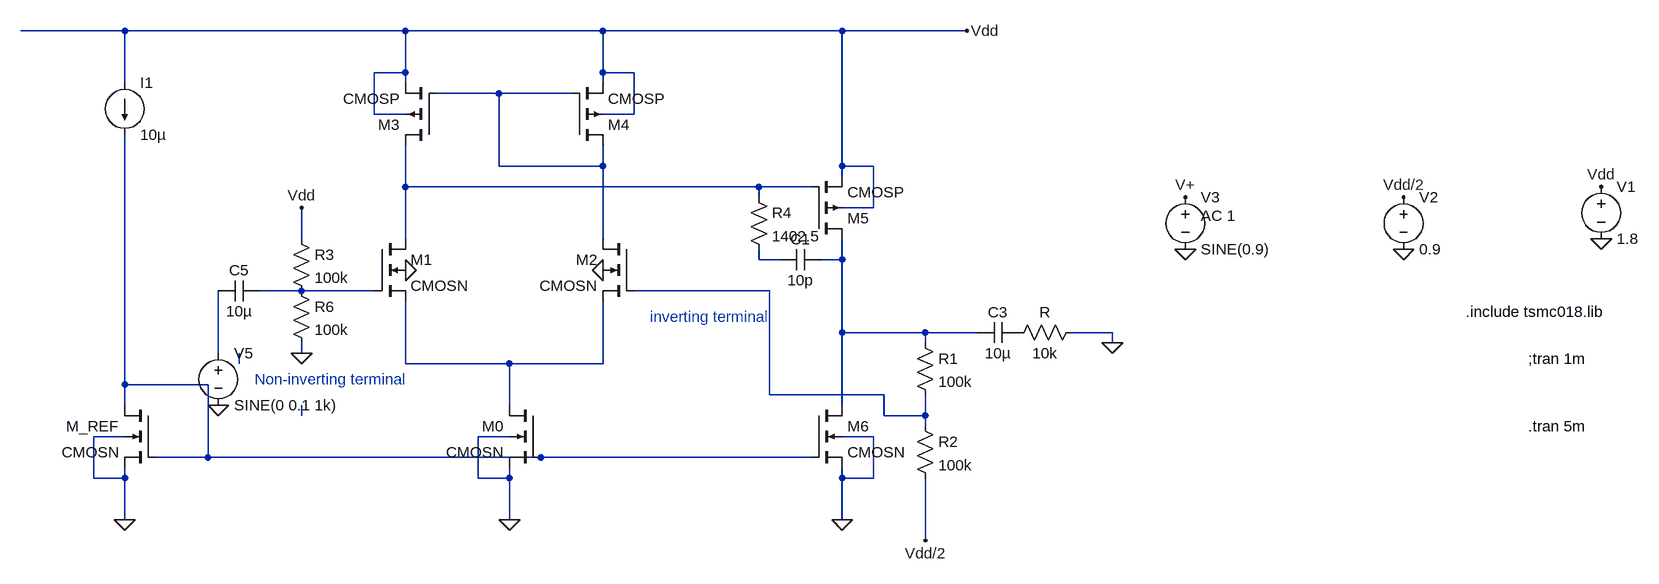
[diagram p0: schematic Closed loop 2 stage OTA.asc]
Closed loop 2 stage OTA.asc, the LTspice schematic file:
Version 4
SHEET 1 1344 1092
WIRE -992 -288 -1152 -288
WIRE -560 -288 -992 -288
WIRE -256 -288 -560 -288
WIRE 112 -288 -256 -288
WIRE 304 -288 112 -288
WIRE -560 -224 -560 -288
WIRE -560 -224 -608 -224
WIRE -256 -224 -256 -288
WIRE -208 -224 -256 -224
WIRE -992 -208 -992 -288
WIRE -560 -208 -560 -224
WIRE -256 -208 -256 -224
WIRE -416 -192 -512 -192
WIRE -304 -192 -416 -192
WIRE -608 -160 -608 -224
WIRE -560 -160 -608 -160
WIRE -208 -160 -208 -224
WIRE -208 -160 -256 -160
WIRE -416 -80 -416 -192
WIRE -256 -80 -256 -112
WIRE -256 -80 -416 -80
WIRE 112 -80 112 -288
WIRE 160 -80 112 -80
WIRE 112 -64 112 -80
WIRE -560 -48 -560 -112
WIRE -16 -48 -560 -48
WIRE 64 -48 -16 -48
WIRE -16 -32 -16 -48
WIRE 160 -16 160 -80
WIRE 160 -16 112 -16
WIRE -720 32 -720 -16
WIRE -560 32 -560 -48
WIRE -256 32 -256 -80
WIRE -16 64 -16 48
WIRE 16 64 -16 64
WIRE 112 64 112 32
WIRE 112 64 80 64
WIRE -720 112 -784 112
WIRE -608 112 -720 112
WIRE 0 112 -208 112
WIRE 112 176 112 64
WIRE 240 176 112 176
WIRE 320 176 240 176
WIRE 528 176 464 176
WIRE 240 192 240 176
WIRE 528 192 528 176
WIRE -848 208 -848 112
WIRE -720 208 -720 192
WIRE -816 224 -816 208
WIRE -560 224 -560 128
WIRE -400 224 -560 224
WIRE -256 224 -256 128
WIRE -256 224 -400 224
WIRE -992 256 -992 -128
WIRE -864 256 -992 256
WIRE 0 272 0 112
WIRE 176 272 0 272
WIRE -992 288 -992 256
WIRE -400 288 -400 224
WIRE 112 288 112 176
WIRE -720 304 -720 288
WIRE 176 304 176 272
WIRE 240 304 240 272
WIRE 240 304 176 304
WIRE 240 320 240 304
WIRE -992 336 -1040 336
WIRE -400 336 -448 336
WIRE 160 336 112 336
WIRE -864 368 -864 256
WIRE -864 368 -944 368
WIRE -352 368 -864 368
WIRE 64 368 -352 368
WIRE -1040 400 -1040 336
WIRE -992 400 -992 384
WIRE -992 400 -1040 400
WIRE -448 400 -448 336
WIRE -400 400 -400 384
WIRE -400 400 -448 400
WIRE 112 400 112 384
WIRE 160 400 160 336
WIRE 160 400 112 400
WIRE -992 464 -992 400
WIRE -400 464 -400 400
WIRE 112 464 112 400
WIRE 240 496 240 400
FLAG -992 464 0
FLAG -400 464 0
FLAG -256 80 0
FLAG -560 80 0
FLAG 112 464 0
FLAG 304 -288 Vdd
FLAG 1280 -48 Vdd
FLAG 1280 32 0
FLAG 976 -32 Vdd/2
FLAG 976 48 0
FLAG 640 48 0
FLAG 640 -32 V+
FLAG 528 192 0
FLAG -848 288 0
FLAG -720 -16 Vdd
FLAG -720 208 0
FLAG 240 496 Vdd/2
SYMBOL cmosn -208 32 M0
SYMATTR InstName M2
SYMATTR Value2 l=1.9u w=20.65u
SYMBOL cmosn -608 32 R0
SYMATTR InstName M1
SYMATTR Value2 l=1.9u w=20.65u
SYMBOL cmosn -352 288 M0
SYMATTR InstName M0
SYMATTR Value2 l=1.9u w=41.3u
SYMBOL cmosn -944 288 M0
SYMATTR InstName M_REF
SYMATTR Value2 l=1.9u w=4.13u
SYMBOL current -992 -208 R0
WINDOW 123 0 0 Left 2
WINDOW 39 0 0 Left 2
SYMATTR InstName I1
SYMATTR Value 10µ
SYMBOL cmosp -512 -112 R180
SYMATTR InstName M3
SYMATTR Value2 l=1.9u w=47.495u
SYMBOL cmosp -304 -112 M180
SYMATTR InstName M4
SYMATTR Value2 l=1.9u w=47.495u
SYMBOL cmosn 64 288 R0
SYMATTR InstName M6
SYMATTR Value2 l=1.9u w=41.3u
SYMBOL cmosp 64 32 M180
SYMATTR InstName M5
SYMATTR Value2 l=1.9u w=94.99u
SYMBOL voltage 1280 -64 R0
WINDOW 123 0 0 Left 2
WINDOW 39 0 0 Left 2
SYMATTR InstName V1
SYMATTR Value 1.8
SYMBOL cap 80 48 R90
WINDOW 0 0 32 VBottom 2
WINDOW 3 32 32 VTop 2
SYMATTR InstName C1
SYMATTR Value 10p
SYMBOL voltage 976 -48 R0
WINDOW 123 0 0 Left 2
WINDOW 39 0 0 Left 2
SYMATTR InstName V2
SYMATTR Value 0.9
SYMBOL voltage 640 -48 R0
WINDOW 123 24 44 Left 2
WINDOW 39 0 0 Left 2
SYMATTR Value2 AC 1
SYMATTR InstName V3
SYMATTR Value SINE(0.9)
SYMBOL cap 320 192 R270
WINDOW 0 32 32 VTop 2
WINDOW 3 0 32 VBottom 2
SYMATTR InstName C3
SYMATTR Value 10µ
SYMBOL res 368 192 R270
WINDOW 0 32 56 VTop 2
WINDOW 3 0 56 VBottom 2
SYMATTR InstName R
SYMATTR Value 10k
SYMBOL res -32 -48 R0
SYMATTR InstName R4
SYMATTR Value 1402.5
SYMBOL voltage -848 192 R0
WINDOW 123 24 44 Left 2
WINDOW 39 0 0 Left 2
SYMATTR InstName V5
SYMATTR Value SINE(0 0.1 1k)
SYMBOL res -736 16 R0
SYMATTR InstName R3
SYMATTR Value 100k
SYMBOL res -736 96 R0
SYMATTR InstName R6
SYMATTR Value 100k
SYMBOL cap -784 96 R90
WINDOW 0 0 32 VBottom 2
WINDOW 3 32 32 VTop 2
SYMATTR InstName C5
SYMATTR Value 10µ
SYMBOL res 224 176 R0
SYMATTR InstName R1
SYMATTR Value 100k
SYMBOL res 224 304 R0
SYMATTR InstName R2
SYMATTR Value 100k
TEXT 1072 144 Left 2 !.include tsmc018.lib
TEXT 1168 216 Left 2 !;tran 1m
TEXT -184 152 Left 2 ;inverting terminal
TEXT 1168 320 Left 2 !.tran 5m
TEXT -792 248 Left 2 ;Non-inverting terminal

The netlist it stands for:
* Closed loop 2 stage OTA.asc
M2 N001 N006 N009 0 CMOSN l=1.9u w=20.65u
M1 N002 N005 N009 0 CMOSN l=1.9u w=20.65u
M0 N009 N010 0 0 CMOSN l=1.9u w=41.3u
M_REF N010 N010 0 0 CMOSN l=1.9u w=4.13u
I1 Vdd N010 10µ
M3 N002 N001 Vdd Vdd CMOSP l=1.9u w=47.495u
M4 N001 N001 Vdd Vdd CMOSP l=1.9u w=47.495u
M6 N004 N010 0 0 CMOSN l=1.9u w=41.3u
M5 N004 N002 Vdd Vdd CMOSP l=1.9u w=94.99u
V1 Vdd 0 1.8
C1 N004 N003 10p
V2 Vdd/2 0 0.9
V3 V+ 0 SINE(0.9) AC 1
C3 N004 P001 10µ
R P001 0 10k
R4 N002 N003 1402.5
V5 N007 0 SINE(0 0.1 1k)
R3 Vdd N005 100k
R6 N005 0 100k
C5 N005 N007 10µ
R1 N004 N006 100k
R2 N006 Vdd/2 100k
.model NMOS NMOS
.model PMOS PMOS
.lib standard.mos
.include tsmc018.lib
;tran 1m
* inverting terminal
.tran 5m
* Non-inverting terminal
.backanno
.end